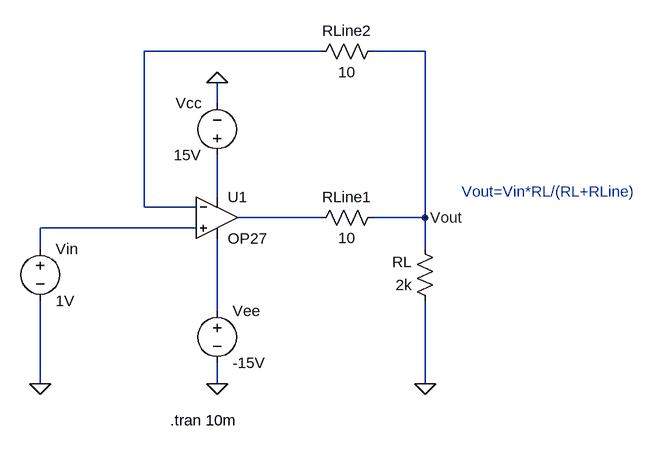
[diagram p0: schematic 2.1.4_DeEffect_of_Line_Resistance_in_wires.asc]
2.1.4_DeEffect_of_Line_Resistance_in_wires.asc, the LTspice schematic file:
Version 4
SHEET 1 880 680
WIRE 352 -16 80 -16
WIRE 512 -16 432 -16
WIRE 192 64 192 32
WIRE 192 208 192 144
WIRE 80 224 80 -16
WIRE 160 224 80 224
WIRE 352 240 224 240
WIRE 512 240 512 -16
WIRE 512 240 432 240
WIRE 160 256 -80 256
WIRE -80 288 -80 256
WIRE 512 288 512 240
WIRE 192 384 192 272
WIRE -80 496 -80 368
WIRE 192 496 192 464
WIRE 512 496 512 368
FLAG -80 496 0
FLAG 192 496 0
FLAG 512 496 0
FLAG 192 32 0
FLAG 512 240 Vout
SYMBOL voltage -80 272 R0
SYMATTR InstName Vin
SYMATTR Value 1V
SYMBOL voltage 192 368 R0
SYMATTR InstName Vee
SYMATTR Value -15V
SYMBOL voltage 192 160 R180
WINDOW 0 24 96 Left 2
WINDOW 3 24 16 Left 2
SYMATTR InstName Vcc
SYMATTR Value 15V
SYMBOL OpAmps/OP27 192 176 R0
SYMATTR InstName U1
SYMBOL Res 448 224 R90
WINDOW 0 0 56 VBottom 2
WINDOW 3 32 56 VTop 2
SYMATTR InstName RLine1
SYMATTR Value 10
SYMBOL Res 528 384 R180
WINDOW 0 36 76 Left 2
WINDOW 3 36 40 Left 2
SYMATTR InstName RL
SYMATTR Value 2k
SYMBOL Res 448 -32 R90
WINDOW 0 0 56 VBottom 2
WINDOW 3 32 56 VTop 2
SYMATTR InstName RLine2
SYMATTR Value 10
TEXT 120 552 Left 2 !.tran 10m
TEXT 568 200 Left 2 ;Vout=Vin*RL/(RL+RLine)

The netlist it stands for:
* 2.1.4_DeEffect_of_Line_Resistance_in_wires.asc
Vin N004 0 1V
Vee N005 0 -15V
Vcc N002 0 15V
XU1 N004 N001 N002 N005 N003 OP27  ; pins In+ In- V+ V- OUT
RLine1 Vout N003 10
RL 0 Vout 2k
RLine2 Vout N001 10
.tran 10m
* Vout=Vin*RL/(RL+RLine)
.lib ADI.lib
.backanno
.end